# EAGLE design TPS5430 (EAGLE 9.5.2)
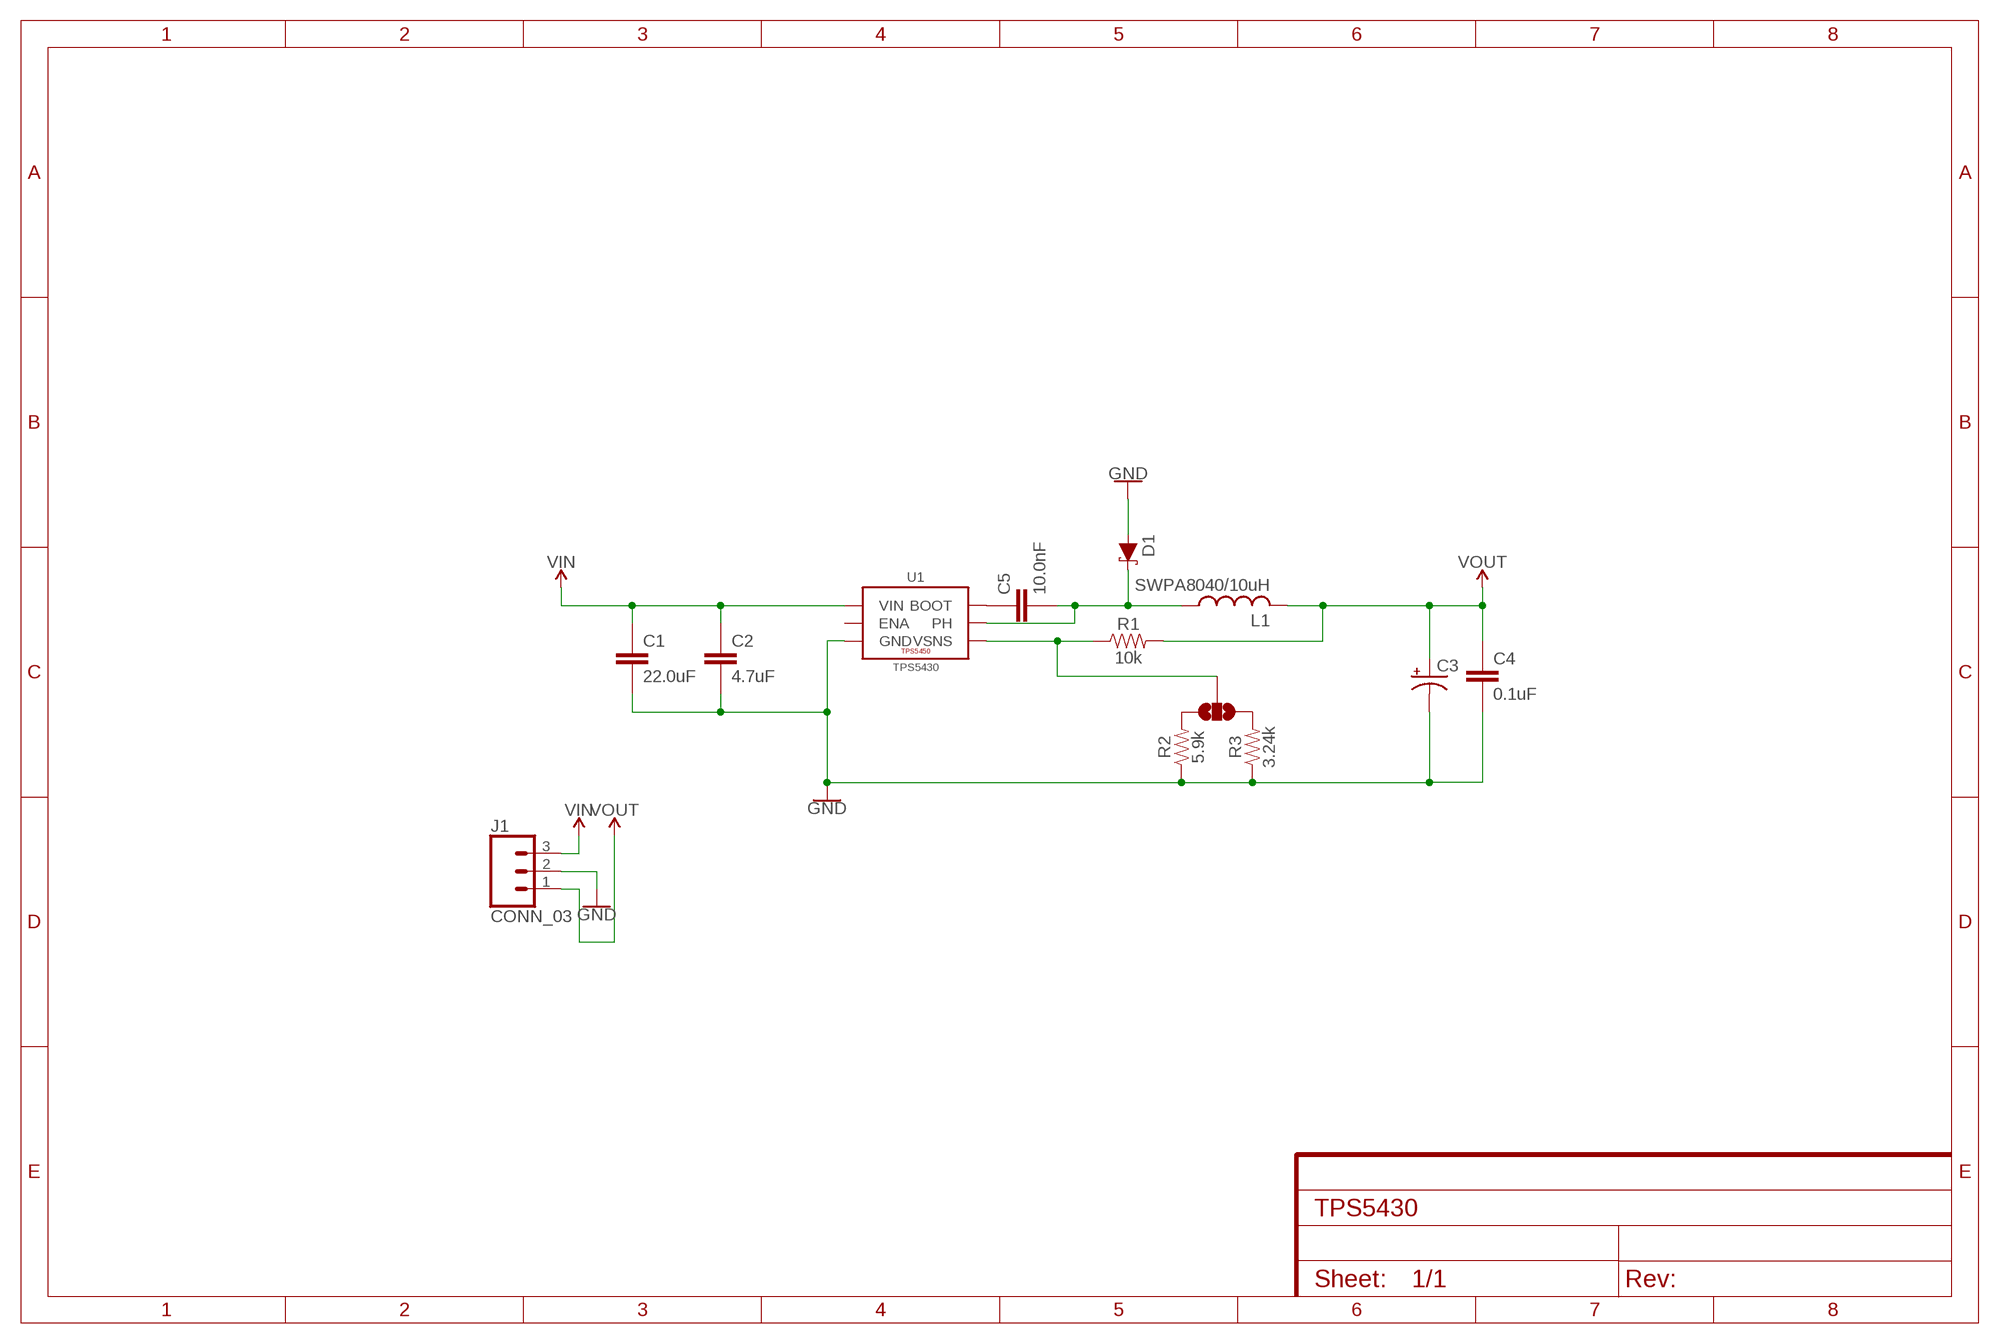
[diagram p0: schematic, sheet 1]

## Parts
C1  22.0uF  CAPACITOR1210  [C1210]
C2  4.7uF  CAPACITOR0603  [C0603]
C3  220uF  CPOL-USD/7343-31R  [D/7343-31R]
C4  0.1uF  CAPACITOR0603  [C0603]
C5  10.0nF  CAPACITOR0603  [C0603]
D1  3A/40V/500mV  DIODE-SCHOTTKY-B340A  [SMA-DIODE]
J1  CONN_03  [1X03_LOCK]
JP1  JUMPER-SMT_3_NO_NO-SILK  [SMT-JUMPER_3_NO_NO-SILK]
L1  SWPA8040/10uH  INDUCTORSWPA8040  [SWPA8040]
R1  10k  RESISTOR0603  [R0603]
R2  5.9k  RESISTOR0603  [R0603]
R3  3.24k  RESISTOR0603  [R0603]
U1  TPS5430  TPS5450  [POWERPAD-SOIC-8]

## Nets
GND: C1.2 C2.2 C3.- C4.2 D1.A J1.2 R2.1 R3.1 U1.6(GND) U1.9(GND) U1.P$1(GND) U1.P$2(GND) U1.P$3(GND) U1.P$4(GND) U1.P$5(GND) U1.P$6(GND)
N$1: JP1.2 R1.1 U1.4(VSNS)
N$2: C5.1 U1.1(BOOT)
N$3: JP1.3 R2.2
N$4: JP1.1 R3.2
N$5: C5.2 D1.C L1.P1 U1.8(PH)
VIN: C1.1 C2.1 J1.3 U1.7(VIN)
VOUT: C3.+ C4.1 J1.1 L1.P2 R1.2
Unconnected: U1.2(NC) U1.3(NC) U1.5(ENA)

## Library data of the parts
C1 C2 C4 C5 = JH:CAPACITOR
C3 = rcl:CPOL-US: POLARIZED CAPACITOR, American symbol; SPICEPREFIX: C
D1 = SparkFun-DiscreteSemi:DIODE-SCHOTTKY: Schottky diode A Schottky diode is a semiconductor diode which has a low forward voltage drop and a very fast switching action.; PROD_ID: DIO-09886
J1 = JH:CONN_03
JP1 = SparkFun-Jumpers:JUMPER-SMT_3_NO: Normally open jumper This jumper has three pads in close proximity to each other. Apply solder to close the connection(s).
L1 = JH:INDUCTOR
R1-R3 = JH:RESISTOR
U1 = JH:TPS5450

## Board
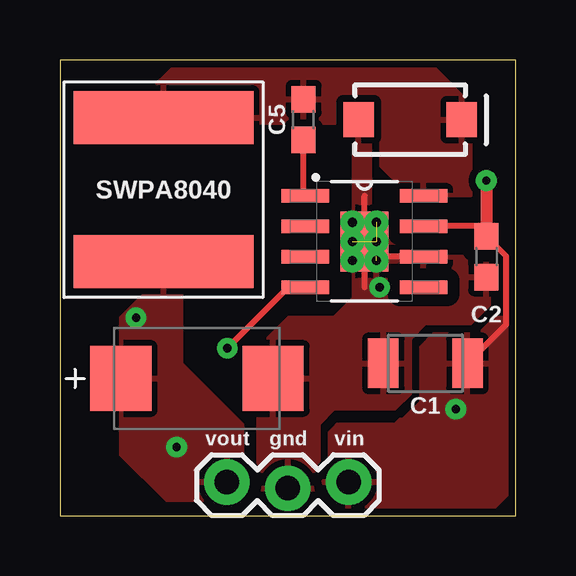
[diagram p1: board, top side]
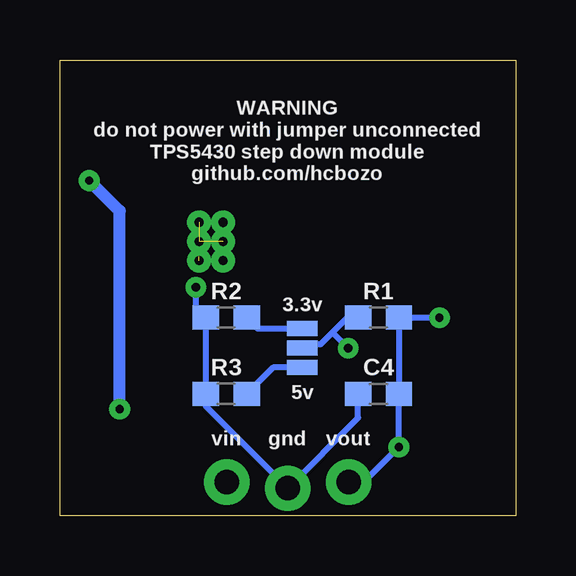
[diagram p2: board, bottom side, seen from below]

Size 19 x 19 mm. Coordinates in mm from the lower left corner, seen from the top.
Outline: 0,0 19,0 19,19 0,19 0,0
Copper layers (1*16): Top 0.035mm / dielectric 1.5mm / Bottom 0.035mm
Design rules "mine": minimum track width 10mil, minimum drill 10mil, track to track 8mil, track to pad 8mil, pad to pad 8mil, via to via 8mil, smd to smd 8mil, copper to edge 8mil, drill to drill 8mil, minimum pad ring 12mil, minimum via ring 10mil, stop-mask expansion 4mil, vias tented up to drill 25mil, thermal gap 10mil

### Footprints (pad centres in the part's own frame; a part is rotated, then mirrored left to right if it is on the bottom)
C1210 = smd 1.27 x 2.06: 1 -1.755,0; 2 1.755,0
C0603 = smd 1.1 x 1: 1 -0.85,0; 2 0.85,0
D/7343-31R = smd 2.55 x 2.7: + 3.175,0; - -3.175,0
SMA-DIODE = smd 1.27 x 1.47: A -2.15,0; C 2.15,0
1X03_LOCK = drill 1.016 pad 1.88: 1 0,0.127; 2 2.54,-0.127; 3 5.08,0.127
SMT-JUMPER_3_NO_NO-SILK = smd 0.635 x 1.27: 1 -0.813,0; 2 0,0; 3 0.813,0
SWPA8040 = smd 2.2 x 7.5: P1 -3,0; P2 3,0
R0603 = smd 1.1 x 1: 1 -0.85,0; 2 0.85,0
POWERPAD-SOIC-8 = smd 1.981 x 0.559: 1 -2.464,1.905; 2 -2.464,0.635; 3 -2.464,-0.635; 4 -2.464,-1.905; 5 2.464,-1.905; 6 2.464,-0.635; 7 2.464,0.635; 8 2.464,1.905 | smd 2.007 x 2.489: 9 0,0 | drill 0.381: P$1 -0.5,0.8; P$2 0.5,0.8; P$3 -0.5,0; P$4 0.5,0; P$5 -0.5,-0.8; P$6 0.5,-0.8

### Placement (x,y rotation side)
C1  15.24,6.35 180 top
C2  17.78,10.79 270 top
C3  5.71,5.71 180 top
C4  5.71,5.08 180 bottom
C5  10.16,16.51 90 top
D1  14.61,16.51 0 top
J1  6.96,1.27 0 top
JP1  8.89,6.99 90 bottom
L1  4.32,13.59 270 top
R1  5.71,8.26 0 bottom
R2  12.06,8.26 0 bottom
R3  12.06,5.08 0 bottom
U1  12.7,11.43 0 top

### Tracks (layer width: path | path; a pad name or v marks a point on that pad's centre or on a via)
GND  (via drill 0.35)  (4 unrouted)
  Top 0.254: 13.2,10.79 U1.P$4 | U1.9 12.7,13.34 | U1.9 12.7,10.79 U1.6 | U1.9 12.7,9.53
  Bottom 0.254: C4.2 6.57,4.08 J1.2 12.91,4.56 R3.1 R2.1 13.34,8.68 v13.34,9.53
  pour Top (isolate 0.508): 18.41,10.79 18.41,9.27 17.14,8 15.24,8 14.61,7.37 14.61,5.08 13.97,4.45 11.43,4.45 10.79,3.81 10.79,0.64 10.16,0 8.89,0 8.26,0.64 8.26,6.99 9.53,8.26 11.43,8.26 12.24,9.07 12.24,16.69 12.7,17.14 12.95,16.89 12.95,12.45 14.61,10.79
N$1  (via drill 0.35)
  Top 0.254: U1.4 9.52,9.53 v6.98,6.99
  Bottom 0.254: JP1.2 8.72,7.15 8.12,7.15 7.63,7.63 | R1.1 7.01,8.26 7.63,7.63 | v6.98,6.99 7.63,7.63
N$2
  Top 0.254: U1.1 10.16,13.41 C5.1
N$3
  Bottom 0.254: R2.2 10.76,7.8 JP1.3
N$4
  Bottom 0.254: JP1.1 10.12,6.17 R3.2
N$5
  pour Top (isolate 0.305, rank 2): 3.81,16.36 11.58,16.36 14.61,13.34 17.14,13.34 17.14,17.14 15.67,18.62 4.65,18.62 3.81,17.78
VIN  (via drill 0.35)
  Top 0.254: C1.1 18.61,7.96 18.61,10.81 C2.1 17.36,12.06 U1.7
  Top 0.508: v17.78,13.97 C2.1
  Bottom 0.508: v16.51,4.45 16.51,12.7 v17.78,13.97
  pour Top (isolate 0.305, rank 2): 10.79,0 10.79,3.17 11.43,3.81 13.97,3.81 14.61,4.45 14.61,8.26 19.05,8.26 19.05,1.27 17.78,0
VOUT  (via drill 0.35)
  Bottom 0.254: v3.17,8.26 R1.2 C4.1 v4.87,2.86 6.33,1.4 J1.1
  pour Top (isolate 0.305): 5.08,10.79 5.08,6.35 7.62,3.81 7.62,1.27 6.99,0.64 4.45,0.64 2.54,2.54 2.54,8.26

### Text on the board
tPlace: vout | gnd | vin
bPlace: WARNING / do not power with jumper unconnected / TPS5430 step down module / github.com/hcbozo | 3.3v | 5v | vout | gnd | vin